# EAGLE schematic FAIO2 (EAGLE 9.2.0)
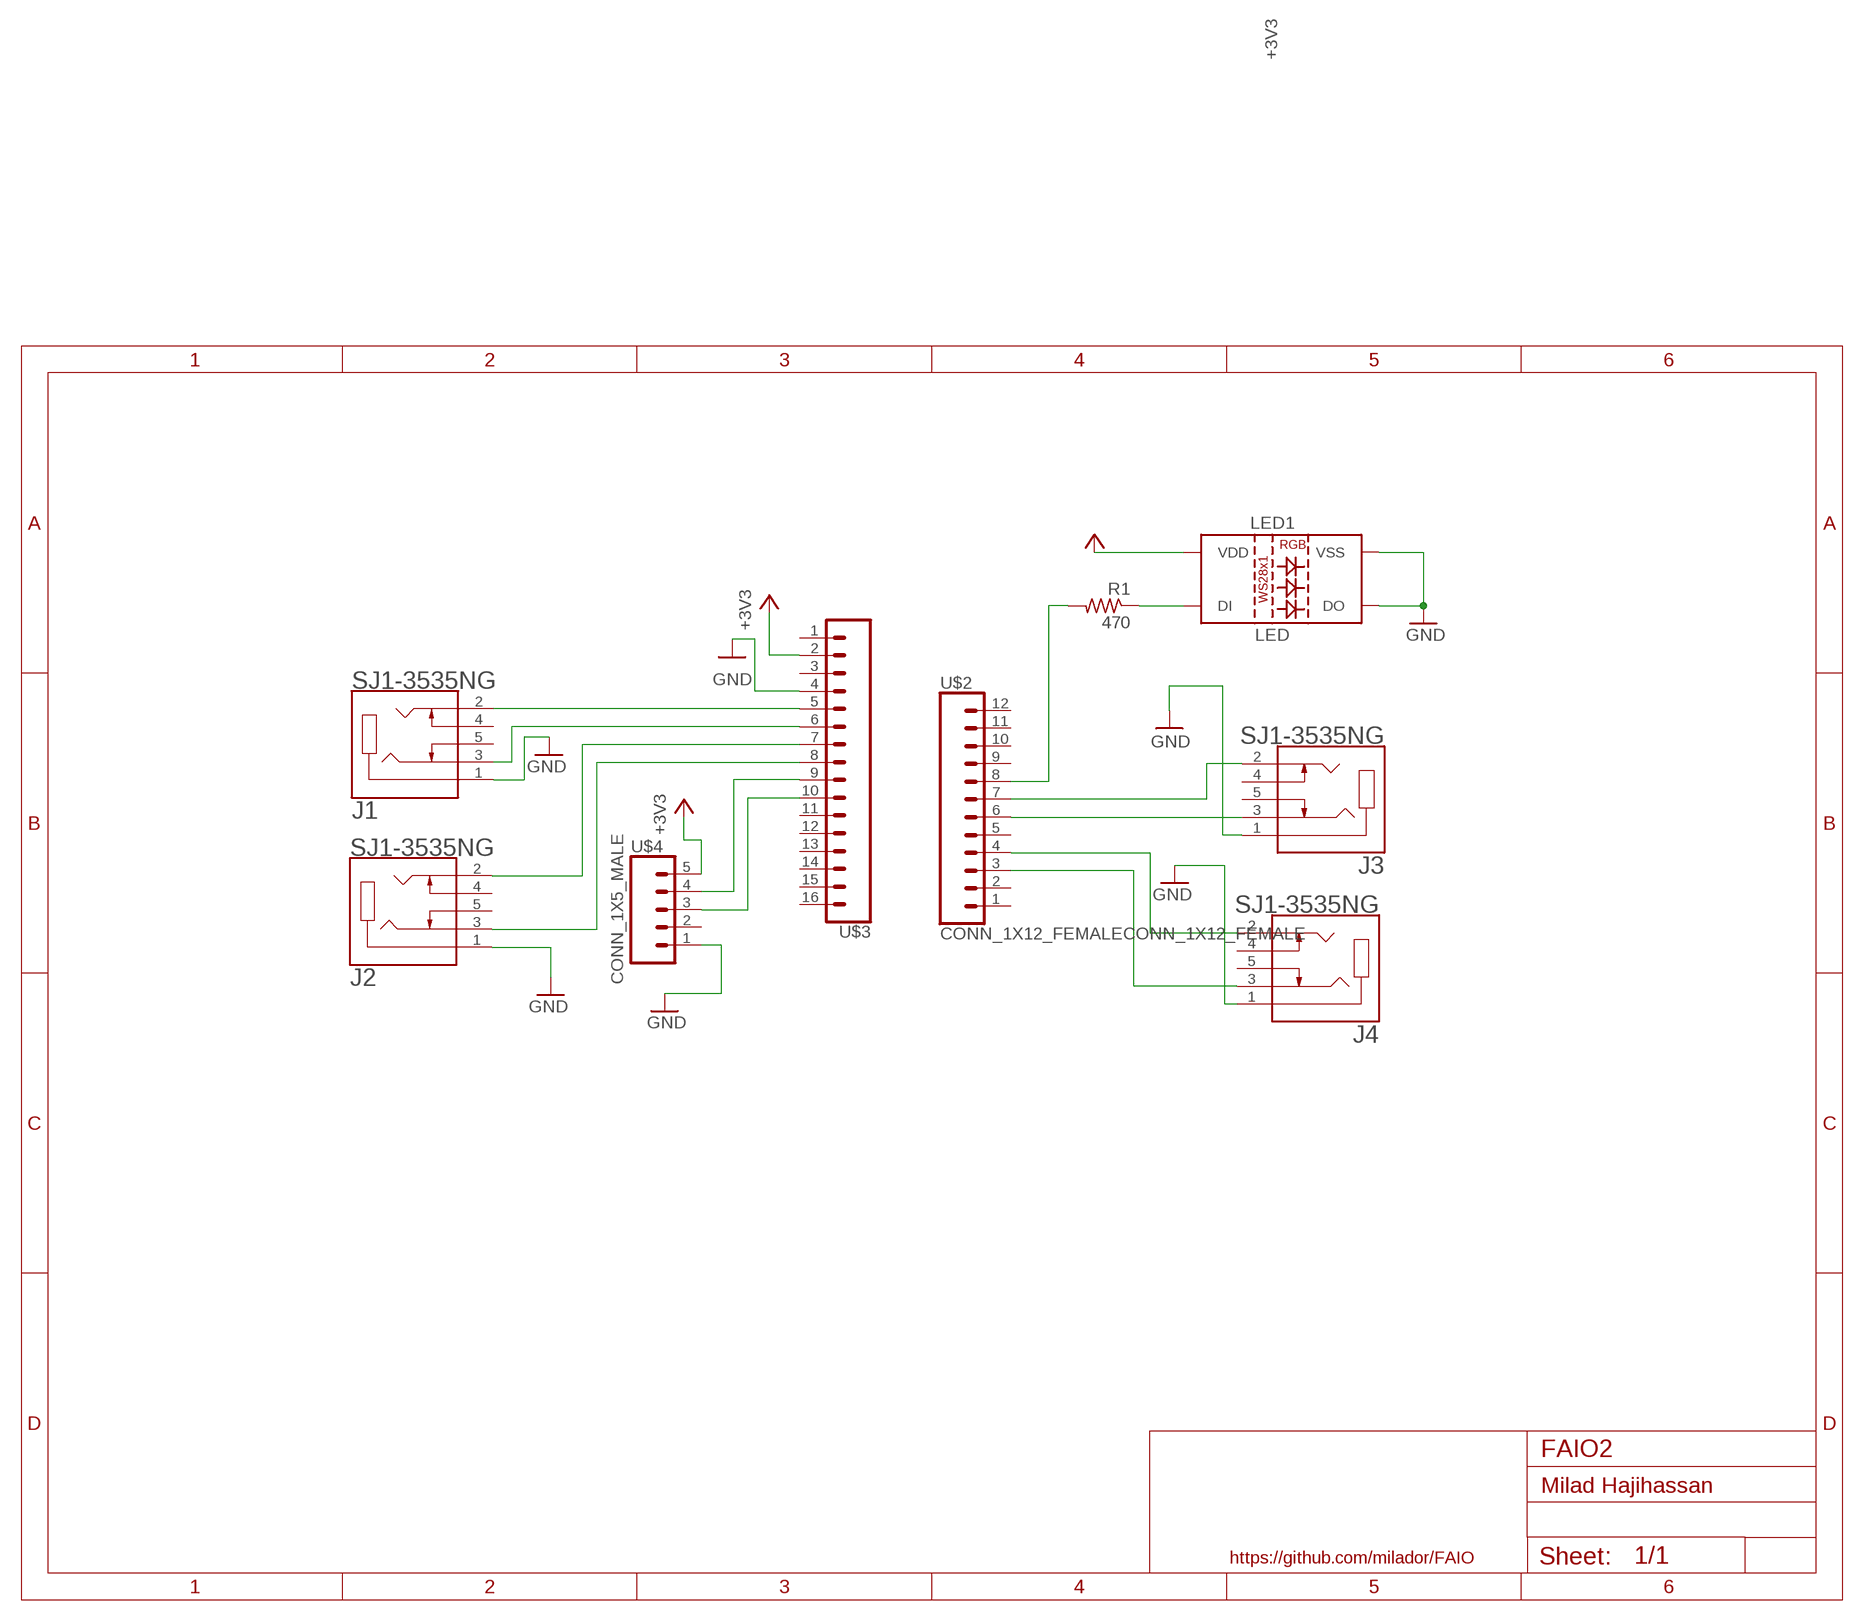
[diagram p0: schematic, sheet 1]

## Parts
J1  SJ1-3535NG  [CUI_SJ1-3535NG]
J2  SJ1-3535NG  [CUI_SJ1-3535NG]
J3  SJ1-3535NG  [CUI_SJ1-3535NG]
J4  SJ1-3535NG  [CUI_SJ1-3535NG]
LED1  LED  NEOPIXELS-5MM  [NEOPIXELS-5MM]
R1  470  R-US_0204/7  [0204/7]
U$2  CONN_1X12_FEMALECONN_1X12_FEMALE  [CONN_1X12]
U$3  CONN_1X16_FEMALECONN_1X16_FEMALE  [CONN_1X16]
U$4  CONN_1X5_MALE  [CONN_1X5]

## Nets
+3V3: LED1.2(VDD) U$3.2 U$4.5
GND: J1.1 J2.1 J3.1 J4.1 LED1.3(VSS) LED1.4(DO) U$3.4 U$4.1
N$1: J3.3 U$2.6
N$2: J3.2 U$2.7
N$3: J4.2 U$2.4
N$4: LED1.1(DI) R1.1
N$5: J4.3 U$2.3
N$6: R1.2 U$2.8
N$7: U$3.9 U$4.4
N$9: J1.2 U$3.5
N$10: J1.3 U$3.6
N$11: J2.2 U$3.7
N$13: U$3.10 U$4.3
N$14: J2.3 U$3.8
Unconnected: J1.4 J1.5 J2.4 J2.5 J3.4 J3.5 J4.4 J4.5 U$2.1 U$2.2 U$2.5 U$2.9 U$2.10 U$2.11 U$2.12 U$3.1 U$3.3 U$3.11 U$3.12 U$3.13 U$3.14 U$3.15 U$3.16 U$4.2

## Notes on the sheet
- Milad Hajihassan
- https://github.com/milador/FAIO

## Library data of the parts
J1-J4 = milador:SJ1-3535NG: SJ1 Series 3.5 mm 12 V Right Angle Through Hole Isolated Stereo Audio Jack; MANUFACTURER: CUI; PARTREV: 1.02; STANDARD: Manufacturer recommendation
LED1 = milador:NEOPIXELS-5MM: WS2812B PTH addressable RGB LED 5mm PTH LED with built-in controller IC. Color: Red/Green/Blue mC Rating: RGB: 390, 660, 180 mcd Forward Voltage: RGB: 2.0, 3.0, 3.0 V SparkFun Products: LED - RGB Addressable, PTH, 5mm Diffused (5 Pack) <https://www.sparkfun.com/products/12986> LED - RGB Addressable, PTH, 5mm Clear (5 Pack) <https://www.sparkfun.com/products/12999> Datasheet referenced for footprint: WS2812B-PTH <https://cdn.sparkfun.com/datasheets/Components/LED/COM-12877.pdf>
R1 = milador:R-US_0204/7
U$2 = milador:CONN_1X12_FEMALE
U$3 = milador:CONN_1X16_FEMALE
U$4 = milador:CONN_1X5_MALE